# EAGLE design MacroKeypad-LED (EAGLE 9.2.2)
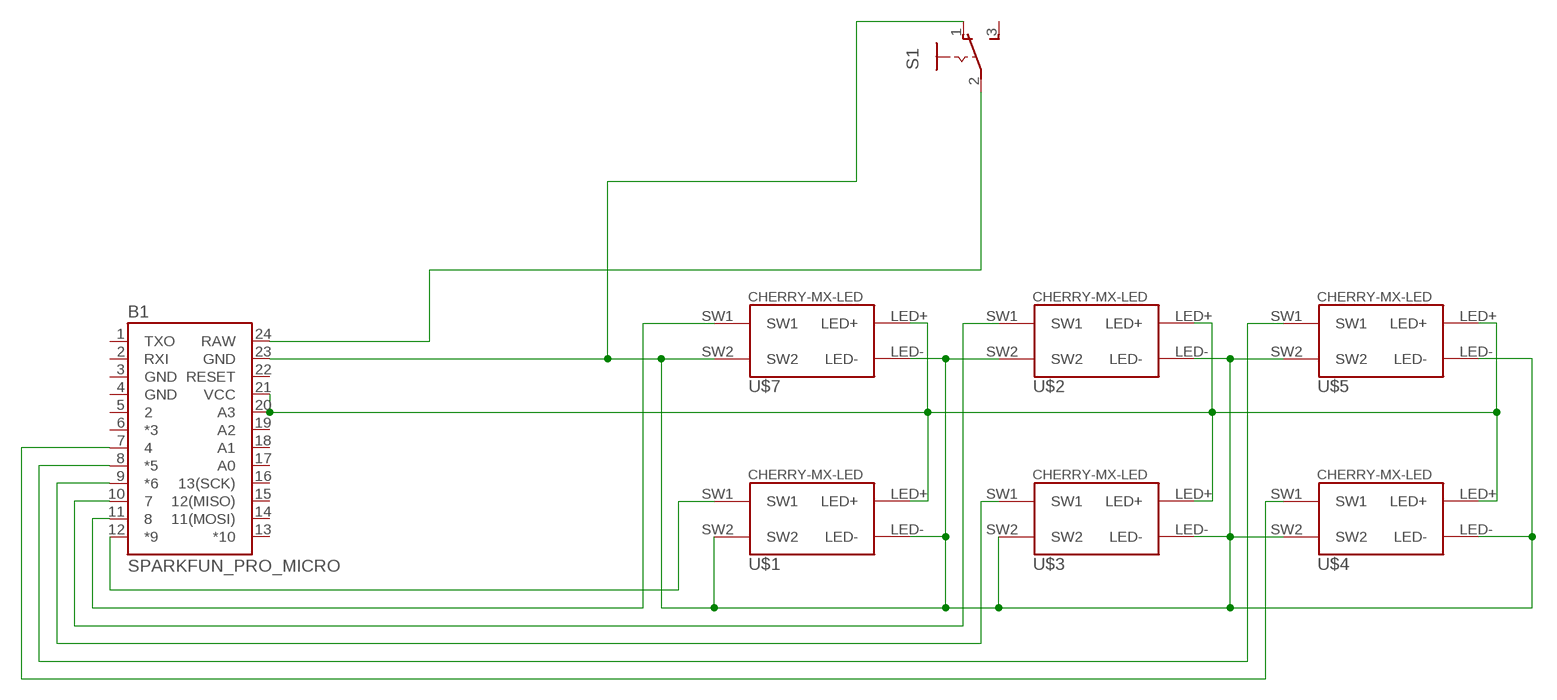
[diagram p0: schematic, sheet 1]

## Parts
B1  SPARKFUN_PRO_MICRO  [SPARKFUN_PRO_MICRO]
S1  255SB  [255SB]
U$1  CHERRY-MX-LED  [CHERRY-MX-LED]
U$2  CHERRY-MX-LED  [CHERRY-MX-LED]
U$3  CHERRY-MX-LED  [CHERRY-MX-LED]
U$4  CHERRY-MX-LED  [CHERRY-MX-LED]
U$5  CHERRY-MX-LED  [CHERRY-MX-LED]
U$7  CHERRY-MX-LED  [CHERRY-MX-LED]

## Nets
GND: B1.23(GND) S1.1(O) U$1.LED- U$1.SW2 U$2.LED- U$2.SW2 U$3.LED- U$3.SW2 U$4.LED- U$4.SW2 U$5.LED- U$5.SW2 U$7.LED- U$7.SW2
LED+: B1.20(A3) B1.21(VCC) U$1.LED+ U$2.LED+ U$3.LED+ U$4.LED+ U$5.LED+ U$7.LED+
RESET: B1.24(RAW) S1.2(P)
SW1: B1.11 U$7.SW1
SW2: B1.9(*6) U$3.SW1
SW3: B1.7 U$4.SW1
SW4: B1.12(*9) U$1.SW1
SW5: B1.10 U$2.SW1
SW6: B1.8(*5) U$5.SW1
Unconnected: B1.1(TXO) B1.2(RXI) B1.5 B1.6(*3) B1.13(*10) B1.14(11(MOSI)) B1.15(12(MISO)) B1.16(13(SCK)) B1.17(A0) B1.18(A1) B1.19(A2) B1.22(RESET) S1.3(S)

## Power pins joined to a net without a drawn wire
GND: B1.3(GND) B1.4(GND)

## Library data of the parts
B1 = SparkFun-Boards:SPARKFUN_PRO_MICRO: SparkFun Pro Micro Atmega32U4 compatible footprint. SparkFun Products: 3.3V/8MHz <https://www.sparkfun.com/products/12587> 5V/16MHz <https://www.sparkfun.com/products/12640>
S1 = switch:255SB: SLIDING SWITCH Distributor Buerklin, 11G810
U$1-U$5 U$7 = cherrymx:CHERRY-MX-LED: Cherry MX series keyswitch with LED

## Board
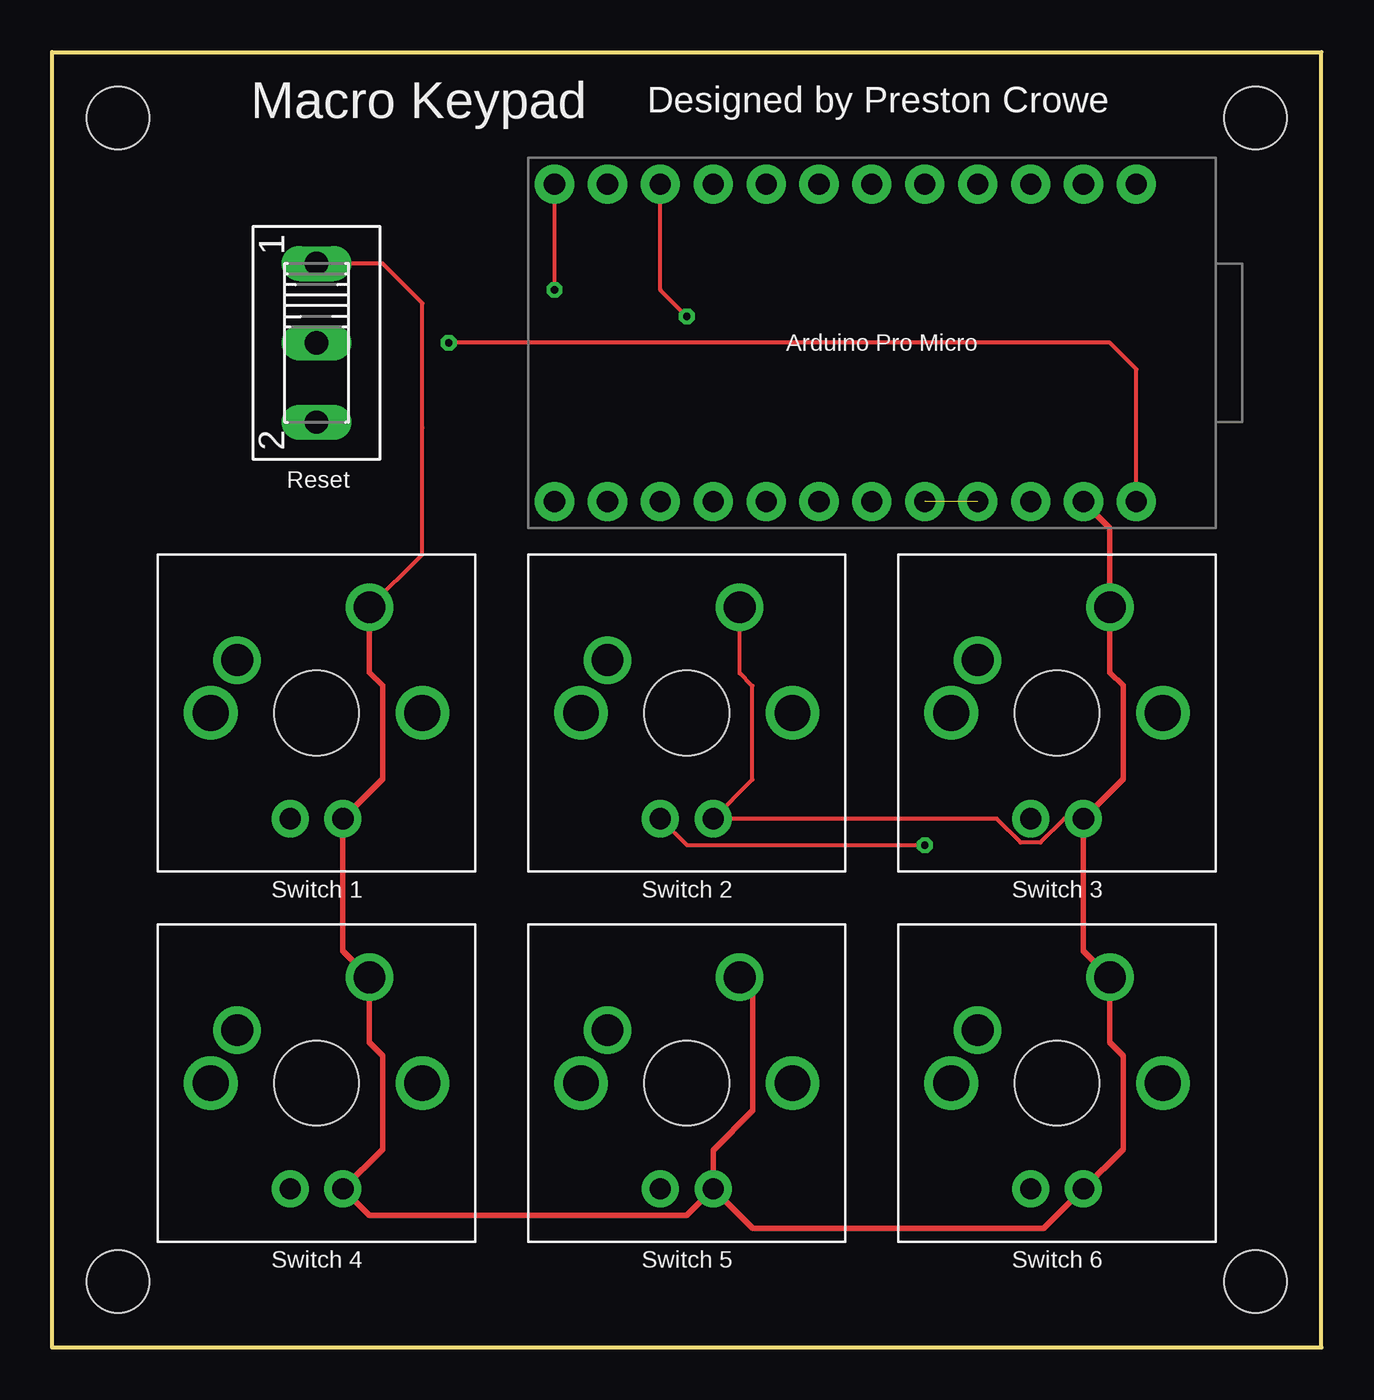
[diagram p1: board, top side]
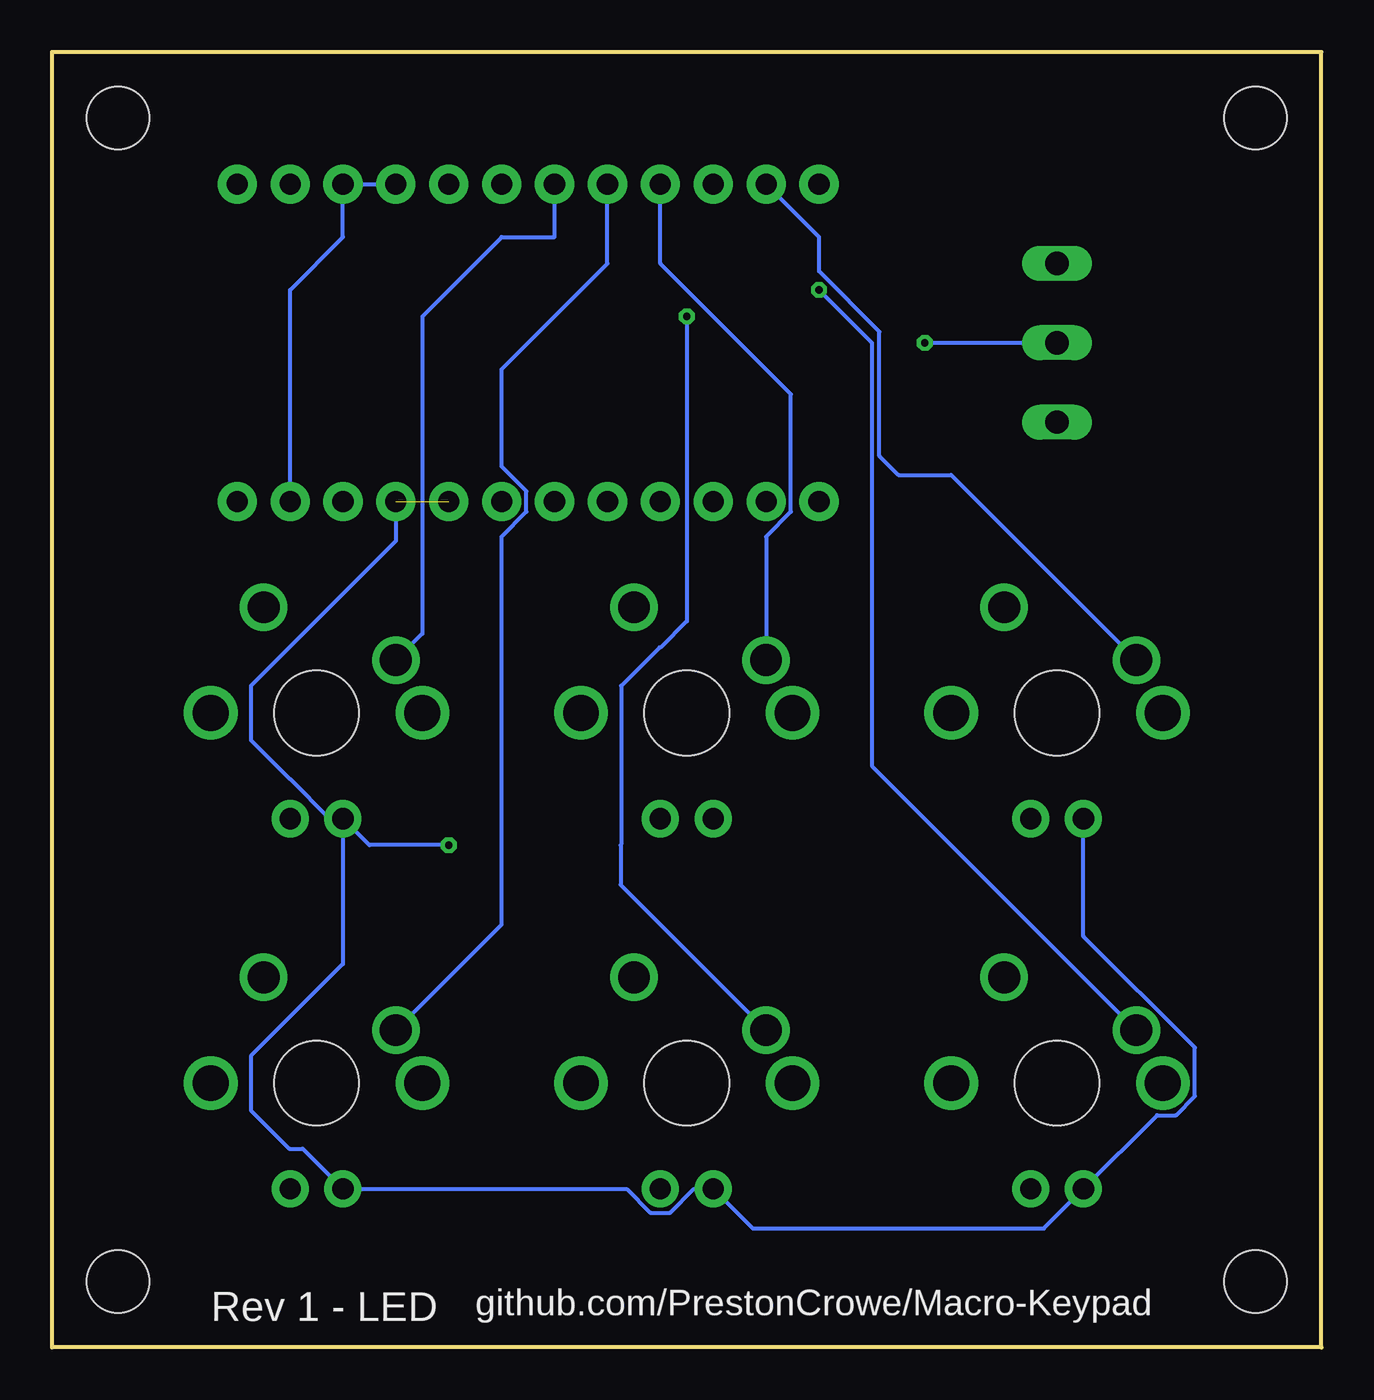
[diagram p2: board, bottom side, seen from below]

Size 60.96 x 62.23 mm. Coordinates in mm from the lower left corner, seen from the top.
Outline: 0,0 60.96,0 60.96,62.23 0,62.23 0,0
Copper layers (1*16): Top 0.035mm / dielectric 1.5mm / Bottom 0.035mm
Design rules "default": minimum track width 6mil, minimum drill 0.35mm, track to track 6mil, track to pad 6mil, pad to pad 6mil, via to via 6mil, smd to smd 6mil, copper to edge 40mil, drill to drill 6mil, minimum pad ring 10mil, minimum via ring 8mil, stop-mask expansion 4mil, vias tented up to drill 0mil, thermal gap 10mil
Holes 3 mm at 57.79,3.17 57.79,59.05 3.18,3.17 3.18,59.05

### Footprints (pad centres in the part's own frame; a part is rotated, then mirrored left to right if it is on the bottom)
SPARKFUN_PRO_MICRO = drill 1.016 pad 1.88: 1 -7.62,12.7; 2 -7.62,10.16; 3 -7.62,7.62; 4 -7.62,5.08; 5 -7.62,2.54; 6 -7.62,0; 7 -7.62,-2.54; 8 -7.62,-5.08; 9 -7.62,-7.62; 10 -7.62,-10.16; 11 -7.62,-12.7; 12 -7.62,-15.24; 13 7.62,-15.24; 14 7.62,-12.7; 15 7.62,-10.16; 16 7.62,-7.62; 17 7.62,-5.08; 18 7.62,-2.54; 19 7.62,0; 20 7.62,2.54; 21 7.62,5.08; 22 7.62,7.62; 23 7.62,10.16; 24 7.62,12.7
255SB = drill 1.118 long: 1 -3.81,0; 2 0,0; 3 3.81,0
CHERRY-MX-LED = drill 1.016 pad 1.778: LED+ -1.27,-5.08; LED- 1.27,-5.08 | drill 1.714 pad 1.93: P$3 -5.08,0; P$4 5.08,0 | drill 1.524 pad 2.286: SW1 -3.81,2.54; SW2 2.54,5.08 | hole 4.064: 0,0

### Placement (x,y rotation side)
B1  39.37,48.26 270 top
S1  12.7,48.26 270 top
U$1  12.7,12.7 0 top
U$2  30.48,12.7 0 top
U$3  30.48,30.48 0 top
U$4  48.26,30.48 0 top
U$5  48.26,12.7 0 top
U$7  12.7,30.48 0 top

### Tracks (layer width: path | path; a pad name or v marks a point on that pad's centre or on a via)
GND
  Top 0.2: U$7.SW2 17.78,38.1 17.78,44.17 | U$4.LED- 48.6,25.4 47.46,24.26 46.52,24.26 45.38,25.4 U$3.LED- 33.63,27.28 33.63,31.78 33.02,32.39 U$3.SW2
  Top 0.203: 17.78,44.17 17.78,50.16 15.88,52.07 S1.1
  Top 0.254: B1.23 50.8,39.37 U$4.SW2 50.8,32.43 51.43,31.8 51.43,27.3 U$4.LED- 49.53,19.05 U$5.SW2 50.8,14.65 51.43,14.02 51.43,9.52 U$5.LED- 47.63,5.71 33.65,5.71 U$2.LED- | U$2.LED- 31.75,9.48 33.65,11.38 33.65,17.14 U$2.SW2 | U$7.SW2 15.24,32.43 15.88,31.8 15.88,27.3 U$7.LED- 13.97,19.05 U$1.SW2 15.24,14.65 15.88,14.02 15.88,9.52 U$1.LED- 15.24,6.35 30.48,6.35 U$2.LED-
  Bottom 0.203: B1.4 B1.3 46.99,53.34 49.53,50.8 B1.23
LED+  (via drill 0.35)  (1 unrouted)
  Top 0.2: U$3.LED+ 30.48,24.13 v41.91,24.13
  Bottom 0.2: B1.21 44.45,38.74 51.41,31.78 51.41,29.18 49.56,27.33 47.63,25.4 U$4.LED+ | U$4.LED+ 46.99,18.42 51.41,14 51.41,11.4 49.56,9.55 48.92,9.55 U$5.LED+ 33.36,7.62 32.22,6.48 31.28,6.48 30.14,7.62 U$2.LED+ 27.3,5.71 13.34,5.71 U$1.LED+ 7.89,11.16 6.98,11.16 6.08,12.06 6.08,14.41 11.43,19.75 U$7.LED+ | v41.91,24.13 45.72,24.13 U$4.LED+
RESET  (via drill 0.35)
  Top 0.203: B1.24 52.07,46.99 50.8,48.26 v19.05,48.26
  Bottom 0.203: v19.05,48.26 S1.2
SW1
  Bottom 0.2: 17.78,41.91 U$7.SW1
  Bottom 0.203: 17.78,41.91 20.32,41.91 21.23,42.82 21.23,48.8 24.13,51.69 24.13,53.34 B1.11
SW2
  Bottom 0.2: 26.67,38.95 U$3.SW1
  Bottom 0.203: 26.67,38.95 25.48,40.15 25.48,45.8 31.75,52.07 B1.9
SW3
  Bottom 0.2: 43.18,34.29 U$4.SW1
  Bottom 0.203: 43.18,34.29 43.18,49.53 39.37,53.34 36.83,53.34 B1.7
SW4  (via drill 0.35)
  Top 0.203: v24.13,50.8 B1.12
  Bottom 0.2: 21.59,34.29 21.59,27.94 U$1.SW1
  Bottom 0.203: 21.59,34.29 21.59,48.26 v24.13,50.8
SW5  (via drill 0.35)
  Top 0.203: v30.48,49.53 29.21,50.8 B1.10
  Bottom 0.2: 30.48,34.89 31.74,33.63 31.78,33.63 33.63,31.78 33.63,24.16 33.65,24.13 33.65,22.23 U$2.SW1
  Bottom 0.203: v30.48,49.53 30.48,34.89
SW6
  Bottom 0.2: U$5.SW1 39.37,20.32 39.37,38.95 38.18,40.15 38.18,41.13 39.37,42.33 39.37,46.99 38.74,47.62
  Bottom 0.203: 38.74,47.62 34.29,52.07 B1.8

### Text on the board
tNames: Designed by Preston Crowe | Macro Keypad | Arduino Pro Micro | Reset | Switch 1 | Switch 2 | Switch 3 | Switch 4 | Switch 5 | Switch 6
bNames: github.com/PrestonCrowe/Macro-Keypad | Rev 1 - LED